# Altium project sonata-board.PrjPcb (part 1 of 2)
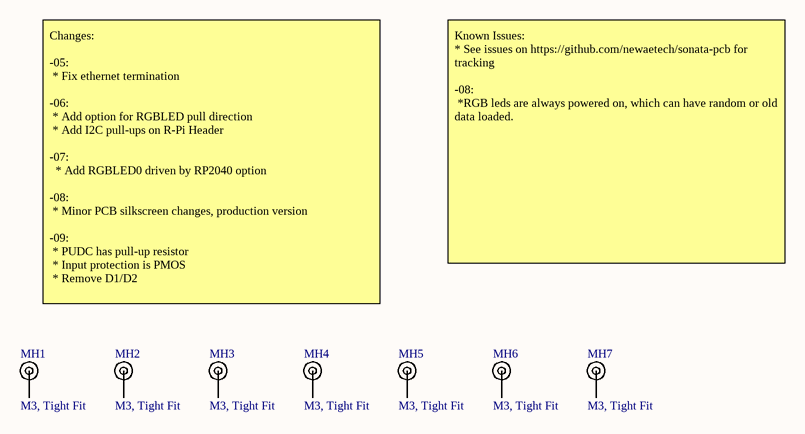
[diagram p0: sb-sonata-mech.SchDoc]
PrjLicense: CC-SA; PrjName: Sonata; PrjRev: 09
9 sheets, 219 parts. Net scope: global (net labels, ports and power ports of the same name join across sheets).
Board file: cheriot-test.PcbDoc
Sheets:
  sb-sonata-mech.SchDoc
  sb-sonata-usbrp.SchDoc
  sb-sonata-industriaal.SchDoc
  sb-sonata-debug.SchDoc
  sb-sonata-led.SchDoc
  sb-sonata-fpgaio2.SchDoc
  sb-sonata-fpganaalog.SchDoc
  sb-sonata-psu.SchDoc
  sb-sonata-hyperram.SchDoc

## Sheet sb-sonata-mech.SchDoc: Mechanical & Title Page
size Letter; Organization: NewAE Technology Inc.; Address1: 1083 Queen St., Suite 196; Address2: Halifax; Address3: NS; Address4: Canada B3H 0B2; SheetNumber: 1; SheetTotal: 20; SheetApproved: YES

### Parts
MH1  M3, Tight Fit  [MOUNT_M3_TIGHT]
MH2  M3, Tight Fit  [MOUNT_M3_TIGHT]
MH3  M3, Tight Fit  [MOUNT_M3_TIGHT]
MH4  M3, Tight Fit  [MOUNT_M3_TIGHT]
MH5  M3, Tight Fit  [MOUNT_M3_TIGHT]
MH6  M3, Tight Fit  [MOUNT_M3_TIGHT]
MH7  M3, Tight Fit  [MOUNT_M3_TIGHT]

### Nets

Not connected (* = marked no-connect by the designer): MH1 1; MH2 1; MH3 1; MH4 1; MH5 1; MH6 1; MH7 1

### Notes on the sheet
- Changes:
  -05:
  * Fix ethernet termination
  -06:
  * Add option for RGBLED pull direction
  * Add I2C pull-ups on R-Pi Header
  -07:
  * Add RGBLED0 driven by RP2040 option
  -08:
  * Minor PCB silkscreen changes, production version
  -09:
  * PUDC has pull-up resistor
  * Input protection is PMOS
  * Remove D1/D2
- Known Issues:
  * See issues on https://github.com/newaetech/sonata-pcb for tracking
  -08:
  *RGB leds are always powered on, which can have random or old data loaded.
- Title:
- Date:
- Rev:
- Time:
- Project:
- Sheet
- of
- License:
- Copyright © NewAE Technology Inc.
- Approved:
- NewAE.com
- File:

### Library data of the parts
MH1-MH7 = MOUNT_M3_TIGHT: Machine screw M3 Mounting Hole; Component Group: Mechanical; PP Material Stack: 0; Part Number: MOUNT_M3_TIGHT; Pin Count: 1; Component Kind: Mechanical; Component Type: Mechanical; PP Rotation: 0

## Sheet sb-sonata-usbrp.SchDoc: RP2040 Controller
size Letter; Organization: NewAE Technology Inc.; Address1: 1083 Queen St., Suite 196; Address2: Halifax; Address3: NS; Address4: Canada B3H 0B2; SheetNumber: 5; SheetTotal: 20; SheetApproved: YES
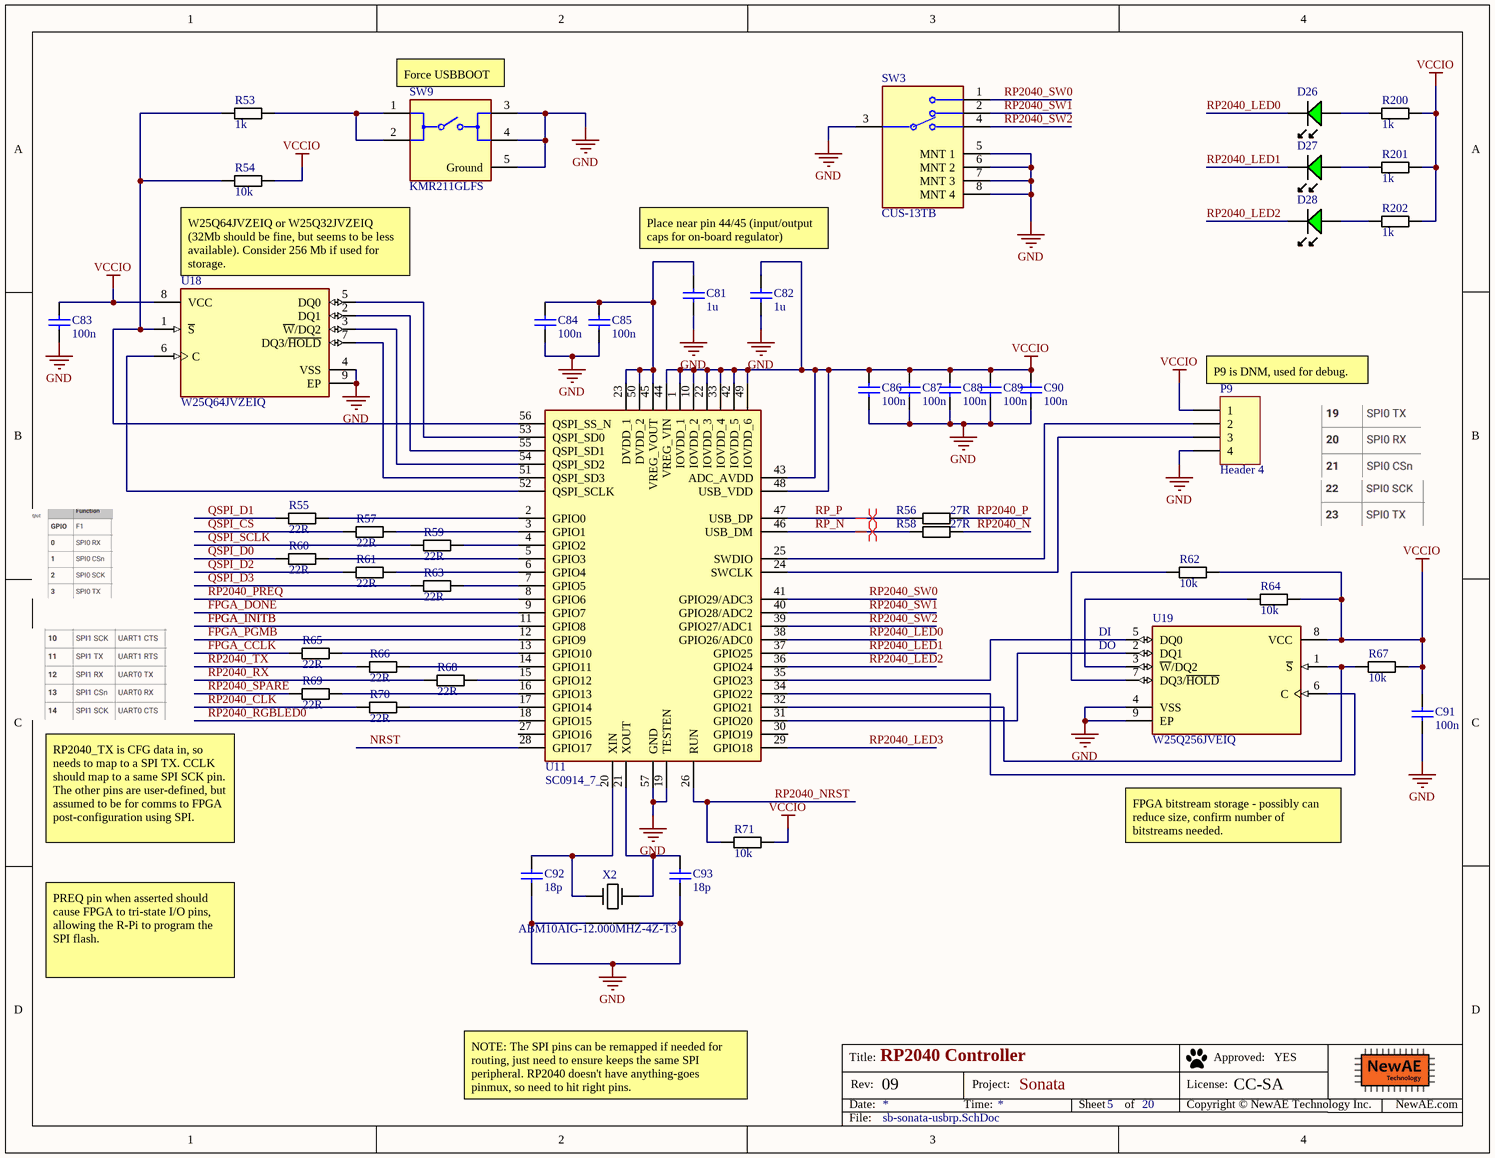
[diagram p1: sb-sonata-usbrp.SchDoc]

### Parts
C81  1u  [CAPC0603_M]
C82  1u  [CAPC0603_M]
C83  100n  [CAPC0402_M]
C84  100n  [CAPC0402_M]
C85  100n  [CAPC0402_M]
C86  100n  [CAPC0402_M]
C87  100n  [CAPC0402_M]
C88  100n  [CAPC0402_M]
C89  100n  [CAPC0402_M]
C90  100n  [CAPC0402_M]
C91  100n  [CAPC0402_M]
C92  18p  [CAPC0402_M]
C93  18p  [CAPC0402_M]
D26  LED, 0603, Green  [LED-0603-GREEN]  (value not drawn)
D27  LED, 0603, Green  [LED-0603-GREEN]  (value not drawn)
D28  LED, 0603, Green  [LED-0603-GREEN]  (value not drawn)
P9  Header 4  [HDR1X4]
R53  1k  [RESC1005X40N]
R54  10k  [RESC1005X40N]
R55  22R  [RESC1005X40N]
R56  27R  [RESC1005X40N]
R57  22R  [RESC1005X40N]
R58  27R  [RESC1005X40N]
R59  22R  [RESC1005X40N]
R60  22R  [RESC1005X40N]
R61  22R  [RESC1005X40N]
R62  10k  [RESC1005X40N]
R63  22R  [RESC1005X40N]
R64  10k  [RESC1005X40N]
R65  22R  [RESC1005X40N]
R66  22R  [RESC1005X40N]
R67  10k  [RESC1005X40N]
R68  22R  [RESC1005X40N]
R69  22R  [RESC1005X40N]
R70  22R  [RESC1005X40N]
R71  10k  [RESC1005X40N]
R200  1k  [RESC1005X40N]
R201  1k  [RESC1005X40N]
R202  1k  [RESC1005X40N]
SW3  CUS-13TB  [FP-CUS-13TB-MFG]
SW9  KMR211GLFS  [FP-KMR211GLFS-MFG]
U11  SC0914_7_  [QFN40P700X700X90-57N-D]
U18  W25Q64JVZEIQ  [WSON68_Micron]
U19  W25Q256JVEIQ  [WSON68_Micron]
X2  ABM10AIG-12.000MHZ-4Z-T3  [2.5x2mm XTAL]

### Nets
GND: C81.2 C82.2 C83.2 C84.2 C85.2 C86.2 C87.2 C88.2 C89.2 C90.2 C91.2 C92.2 C93.2 P9.4 SW3.3(C) SW3.5(MNT_1) SW3.6(MNT_2) SW3.7(MNT_3) SW3.8(MNT_4) SW9.3 SW9.4 SW9.5(Ground) U11.19(TESTEN) U11.57(GND) U18.4(VSS) U18.9(EP) U19.4(VSS) U19.9(EP) X2.2(GND) X2.4(GND)
VCCIO: C82.1 C83.1 C86.1 C87.1 C88.1 C89.1 C90.1 C91.1 P9.1 R54.1 R62.1 R64.1 R67.2 R71.2 R200.2 R201.2 R202.2 U11.1(IOVDD_1) U11.10(IOVDD_2) U11.22(IOVDD_3) U11.33(IOVDD_4) U11.42(IOVDD_5) U11.43(ADC_AVDD) U11.44(VREG_VIN) U11.48(USB_VDD) U11.49(IOVDD_6) U18.8(VCC) U19.8(VCC)  [project net 3V3_FTDI]
FPGA_CCLK: R65.1
FPGA_DONE: U11.9(GPIO7)
FPGA_INITB: U11.11(GPIO8)
FPGA_PGMB: U11.12(GPIO9)
NRST: U11.28(GPIO17)
QSPI_CS: R57.1
QSPI_D0: R60.1
QSPI_D1: R55.1
QSPI_D2: R61.1
QSPI_D3: R63.1
QSPI_SCLK: R59.1
RP2040_CLK: R70.1
RP2040_LED0: D26.K U11.38(GPIO26/ADC0)
RP2040_LED1: D27.K U11.37(GPIO25)
RP2040_LED2: D28.K U11.36(GPIO24)
RP2040_LED3: U11.29(GPIO18)
RP2040_N: R58.1
RP2040_NRST: R71.1 U11.26(RUN)
RP2040_P: R56.1
RP2040_PREQ: U11.8(GPIO6)
RP2040_RGBLED0: U11.18(GPIO15)
RP2040_RX: R68.1
RP2040_SPARE: R69.1
RP2040_SW0: SW3.1 U11.41(GPIO29/ADC3)
RP2040_SW1: SW3.2 U11.40(GPIO28/ADC2)
RP2040_SW2: SW3.4 U11.39(GPIO27/ADC1)
RP2040_TX: R66.1
RP_N: R58.2 U11.46(USB_DM)
RP_P: R56.2 U11.47(USB_DP)
NetC81_1: C81.1 C84.1 C85.1 U11.23(DVDD_1) U11.45(VREG_VOUT) U11.50(DVDD_2)
NetC92_1: C92.1 U11.20(XIN) X2.1(IN)
NetC93_1: C93.1 U11.21(XOUT) X2.3(OUT)
NetD26_A: D26.A R200.1
NetD27_A: D27.A R201.1
NetD28_A: D28.A R202.1
NetP9_2: P9.2 U11.25(SWDIO)
NetP9_3: P9.3 U11.24(SWCLK)
NetR53_1: R53.1 R54.2 U11.56(QSPI_SS_N) U18.1(~{S})
NetR53_2: R53.2 SW9.1 SW9.2
NetR55_2: R55.2 U11.2(GPIO0)
NetR57_2: R57.2 U11.3(GPIO1)
NetR59_2: R59.2 U11.4(GPIO2)
NetR60_2: R60.2 U11.5(GPIO3)
NetR61_2: R61.2 U11.6(GPIO4)
NetR62_2: R62.2 U19.7(DQ3/~{HOLD})
NetR63_2: R63.2 U11.7(GPIO5)
NetR64_2: R64.2 U19.3(~{W}/DQ2)
NetR65_2: R65.2 U11.13(GPIO10)
NetR66_2: R66.2 U11.14(GPIO11)
NetR67_1: R67.1 U11.32(GPIO21) U19.1(~{S})
NetR68_2: R68.2 U11.15(GPIO12)
NetR69_2: R69.2 U11.16(GPIO13)
NetR70_2: R70.2 U11.17(GPIO14)
NetU11_31: U11.31(GPIO20) U19.2(DQ1)
NetU11_34: U11.34(GPIO22) U19.6(C)
NetU11_35: U11.35(GPIO23) U19.5(DQ0)
NetU11_51: U11.51(QSPI_SD3) U18.7(DQ3/~{HOLD})
NetU11_52: U11.52(QSPI_SCLK) U18.6(C)
NetU11_53: U11.53(QSPI_SD0) U18.5(DQ0)
NetU11_54: U11.54(QSPI_SD2) U18.3(~{W}/DQ2)
NetU11_55: U11.55(QSPI_SD1) U18.2(DQ1)

Not connected (* = marked no-connect by the designer): U11 27(GPIO16) 30(GPIO19)

### Layout directives
differential pair; differential pair class USB_DIFF_PAIR: RP_N, RP_P

### Notes on the sheet
- (near SW9) Force USBBOOT
- W25Q64JVZEIQ or W25Q32JVZEIQ (32Mb should be fine, but seems to be less available). Consider 256 Mb if used for storage.
- Place near pin 44/45 (input/output caps for on-board regulator)
- (near P9) P9 is DNM, used for debug.
- (near U19) DI
- (near U19) DO
- RP2040_TX is CFG data in, so needs to map to a SPI TX. CCLK should map to a same SPI SCK pin. The other pins are user-defined, but assumed to be for comms to FPGA post-configuration using SPI.
- FPGA bitstream storage - possibly can reduce size, confirm number of bitstreams needed.
- PREQ pin when asserted should cause FPGA to tri-state I/O pins, allowing the R-Pi to program the SPI flash.
- NOTE: The SPI pins can be remapped if needed for routing, just need to ensure keeps the same SPI peripheral. RP2040 doesn't have anything-goes pinmux, so need to hit right pins.
- Title:
- Date:
- Rev:
- Time:
- Project:
- Sheet
- of
- License:
- Copyright © NewAE Technology Inc.
- Approved:
- NewAE.com
- File:

### Library data of the parts
C81 C82 = CCHIP-1u-0603: 1u, 0603, 50V; Manufacture Part Number 1: CL10A105KB8NNNC; Component Group: Capacitor; Case-EIA: 0603; Case-Metric: 1608; Rated Voltage: 50VDC; Part Number: CCHIP-1u-0603; Footprint: 0603; Pin Count: 2; Supplier 1: Digi-Key; Supplier Part Number 1: 1276-1860-1-ND; Value: 1u; Mounting Technology: SMT; Component Kind: Standard; Component Type: Standard
C83-C91 = CCHIP-100n-0402: 100n, 0402; Manufacture Part Number 1: CGA2B3X7R1V104K050BB; Component Group: Capacitor; Case-EIA: 0402; Part Number: CCHIP-100n-0402; Footprint: 0402; Pin Count: 2; Supplier 1: Digi-Key; Supplier Part Number 1: 445-6901-1-ND; Value: 100n; Mounting Technology: SMT; Component Kind: Standard; Component Type: Standard
C92 C93 = CCHIP-18p-0402: 18p, 0402; Manufacture Part Number 1: GRM1555C1H180JA01D; Component Group: Capacitor; Case-EIA: 0402; Part Number: CCHIP-18p-0402; Footprint: 0402; Pin Count: 2; Supplier 1: Digi-Key; Supplier Part Number 1: 490-5858-1-ND; Value: 18p; Mounting Technology: SMT; Component Kind: Standard; Component Type: Standard
D26-D28 = LEDCHIP_0603_GREEN: Chip LED, Green; Manufacture 1: Kingbright; Manufacture Part Number 1: APT1608CGCK; Component Group: Optical; PP Material Stack: 16; PP Rotation: -90; Part Number: LEDCHIP_0603_GREEN; Pin Count: 2; Supplier 1: Digi-Key; Supplier Part Number 1: 754-1116-1-ND; Mounting Technology: SMT; Component Kind: Standard; Component Type: Standard
P9 = Header 4: Header, 4-Pin; LatestRevisionDate: 17-Jul-2002; LatestRevisionNote: Re-released for DXP Platform.; Publisher: Altium Limited
R53 R200-R202 = RCHIP-1K-0402: 1k res, 0402, 1%, 1/16W; Manufacture 1: Yageo; Manufacture Part Number 1: RC0402FR-071KL; Component Group: Resistor; Case-EIA: 0402; Case-Metric: 1005; Rated Power: 0.063W; Rated Voltage: 75VDC; Part Number: RCHIP-1K-0402; Footprint: 0402; Pin Count: 2; Supplier 1: Digi-Key; Supplier Part Number 1: 311-1.00KLRCT-ND; Value: 1k; Tolerance: 1%; Mounting Technology: SMT; Temperature Range: -55C to 155C; Component Kind: Standard; Component Type: Standard
R54 R62 R64 R67 R71 = RCHIP-10K-0402: 10k res, 0402, 1%, 1/16W; Manufacture 1: Yageo; Manufacture Part Number 1: RC0402FR-0710KL; Component Group: Resistor; Case-EIA: 0402; Case-Metric: 1005; Rated Power: 0.063W; Rated Voltage: 75VDC; Part Number: RCHIP-10K-0402; Footprint: 0402; Pin Count: 2; Supplier 1: Digi-Key; Supplier Part Number 1: 311-10.0KLRCT-ND; Value: 10k; Tolerance: 1%; Mounting Technology: SMT; Temperature Range: -55C to 155C; Component Kind: Standard; Component Type: Standard
R55 R57 R59-R61 R63 R65 R66 R68-R70 = RCHIP-22R-0402: 22R res, 0402, 1%, 1/16W; Manufacture 1: Yageo; Manufacture Part Number 1: RC0402FR-0722RL; Component Group: Resistor; Case-EIA: 0402; Case-Metric: 1005; Rated Power: 0.063W; Rated Voltage: 75VDC; Part Number: RCHIP-22R-0402; Footprint: 0402; Pin Count: 2; Supplier 1: Digi-Key; Supplier Part Number 1: 311-22.0LRCT-ND; Value: 22R; Tolerance: 1%; Mounting Technology: SMT; Temperature Range: -55C to 155C; Component Kind: Standard; Component Type: Standard
R56 R58 = RCHIP-27R-0402: 27R res, 0402, 1%, 1/16W; Manufacture 1: Yageo; Manufacture Part Number 1: RC0402FR-0727RL; Component Group: Resistor; Case-EIA: 0402; Case-Metric: 1005; Rated Power: 0.063W; Rated Voltage: 75VDC; Part Number: RCHIP-27R-0402; Footprint: 0402; Pin Count: 2; Supplier 1: Digi-Key; Supplier Part Number 1: YAG3086CT-ND; Value: 27R; Tolerance: 1%; Mounting Technology: SMT; Temperature Range: -55C to 155C; Component Kind: Standard; Component Type: Standard
SW3 = CMP-71745-000014-1: SWITCH SLIDE SP3T 300MA 4V; Actuator Length: 1.5mm; Electrical Life: 10000Cycles; Max Voltage Rating (DC): 20V; Switch Function: On-On-On; Actuator Material: Nylon; Actuator Type: Standard; Contact Style: Non-Shorting; Contact Plating: Gold; Termination: Gull Wing; Radiation Hardening: No; Series: CUS; Max Operating Temperature: 70°C; Mount: Surface Mount; Switch Travel: 1.5mm; Packaging: Tape and Reel; Min Operating Temperature: -20°C; Contact Material: Copper Alloy; Orientation: Right Angle; Voltage Rating (DC): 4V; RoHS Compliant: Yes; Current Rating: 300mA; Throw Configuration: SP3T
SW9 = CMP-10040-000023-1: SWITCH TACTILE SPST-NO 0.05A 32V; Switch Function: Off-Mom; Throw Configuration: SPST; Switch Travel: 0.2mm; Current Rating: 50mA; Illumination Type: Non-Illuminated; Actuator Length: 0.5mm; Power Rating: 1W; Operating Force: 1.2N; Actuator Type: Standard; Mechanical Life: 200000Cycles; REACH SVHC: No SVHC; Voltage Rating (DC): 32V; Length: 2.8mm; Min Operating Temperature: -40°C; Mount: Surface Mount; Max Voltage Rating (DC): 32V; Width: 2.8mm; Depth: 4.6mm; Packaging: Tape and Reel; Lead Free: Lead Free; Contact Material: Silver; Termination: Gull Wing; Package Quantity: 1; Contact Current Rating: 50mA; Orientation: Straight; Max Operating Temperature: 85°C; Radiation Hardening: No; Max Current Rating: 50mA; Contact Plating: Silver
U11 = SC0914_7_: Connector; Manufacturer_Name: RASPBERRY-PI; Manufacturer_Part_Number: SC0914(7); Datasheet Link: https://www.mouser.com/datasheet/2/635/rp2040_datasheet-3048960.pdf; Height: 0.9mm; Mouser Part Number: 358-SC09147; Mouser Price/Stock: https://www.mouser.co.uk/ProductDetail/Raspberry-Pi/SC09147?qs=T%252BzbugeAwjhSpdbCB4ve%252Bg%3D%3D
U18 = MT25QL256ABA1EW9-0SIT: IC FLASH 64M SPI 133MHZ 8WPDFN; Manufacture 1: Winbond; Component Group: Digital IC; PP Material Stack: 0; Part Number: W25Q64JVZEIQ; Footprint: WSON-8x6; Manufacture Part Number 1: W25Q64JVZEIQ; Pin Count: 9; Supplier 1: Digi-Key; Mounting Technology: SMT; RoHS: Yes; Component Kind: Standard; Component Type: Standard; PP Rotation: 0; PP Rotation1: 0
U19 = MT25QL256ABA1EW9-0SIT: IC FLASH 256M SPI 133MHZ 8WPDFN; Manufacture 1: Winbond; Component Group: Digital IC; PP Material Stack: 0; Part Number: W25Q256JVEIQ; Footprint: WSON-8x6; Manufacture Part Number 1: W25Q256JVEIQ; Pin Count: 9; Supplier 1: Digi-Key; Mounting Technology: SMT; RoHS: Yes; Component Kind: Standard; Component Type: Standard; PP Rotation: 0; PP Rotation1: 0
X2 = ABM10AIG-12.000MHZ-4Z-T3: 12MHz, SMD; Manufacture 1: Abracon LLC; Component Group: Crystal; PP Material Stack: 0; Part Number: ABM10AIG-12.000MHZ-4Z-T3; Manufacture Part Number 1: ABM10AIG-12.000MHZ-4Z-T3; Pin Count: 4; Supplier 1: Digi-Key; Supplier Part Number 1: 535-13360-1-ND; Value: 12.000MHz; Mounting Technology: SMT; Component Kind: Standard; Component Type: Standard; PP Rotation: 0

## Sheet sb-sonata-industriaal.SchDoc: RS485,RS232,Eth Connectors
size Letter; Organization: NewAE Technology Inc.; Address1: 1083 Queen St., Suite 196; Address2: Halifax; Address3: NS; Address4: Canada B3H 0B2; SheetNumber: 6; SheetTotal: 20; SheetApproved: YES
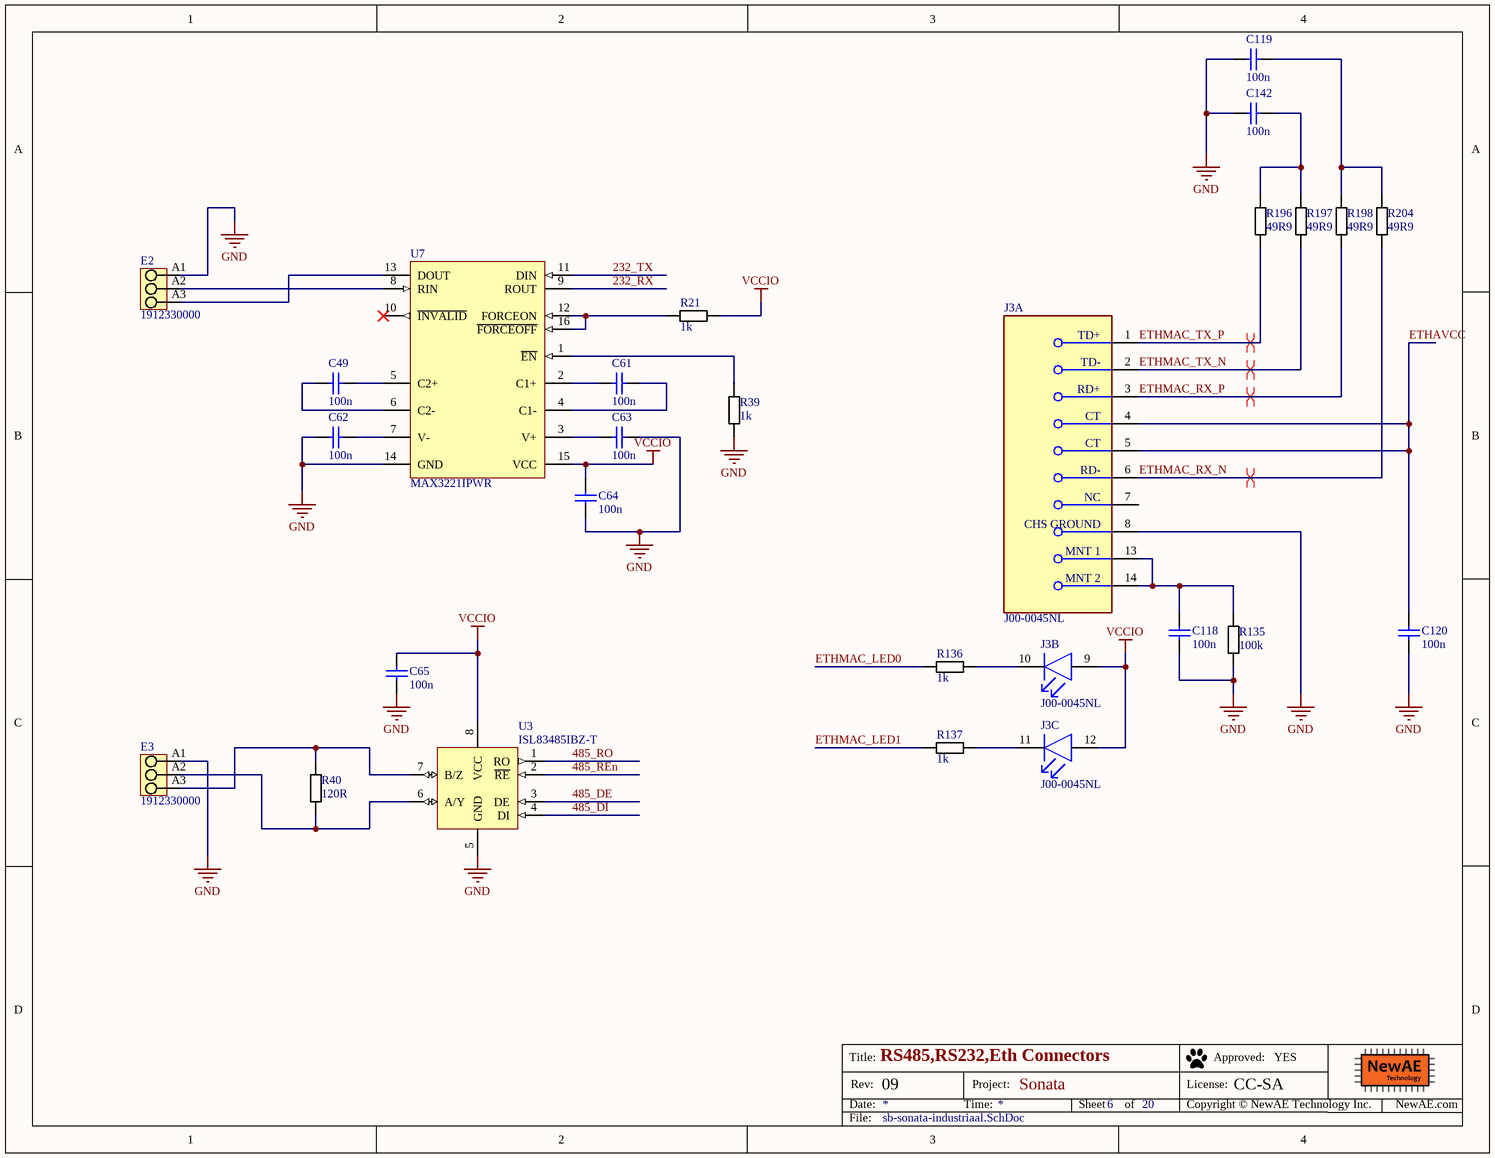
[diagram p2: sb-sonata-industriaal.SchDoc]

### Parts
C49  100n  [CAPC0402_M]
C61  100n  [CAPC0402_M]
C62  100n  [CAPC0402_M]
C63  100n  [CAPC0402_M]
C64  100n  [CAPC0402_M]
C65  100n  [CAPC0402_M]
C118  100n  [CAPC0402_M]
C119  100n  [CAPC0402_M]
C120  100n  [CAPC0402_M]
C142  100n  [CAPC0402_M]
E2  1912330000  [PS_3_5_90_03]
E3  1912330000  [PS_3_5_90_03]
J3  J00-0045NL  [FP-J00-0045NL-MFG]  (parts A,B,C of 3)
R21  1k  [RESC1608X55N]
R39  1k  [RESC1608X55N]
R40  120R  [RESC1608X55N]
R135  100k  [RESC1005X40N]
R136  1k  [RESC1608X55N]
R137  1k  [RESC1608X55N]
R196  49R9  [RESC2012X70N]
R197  49R9  [RESC2012X70N]
R198  49R9  [RESC2012X70N]
R204  49R9  [RESC2012X70N]
U3  ISL83485IBZ-T  [SOIC8_NARROW]
U7  MAX3221IPWR  [PW0016A_L]

### Nets
GND: C62.2 C63.1 C64.1 C65.2 C118.2 C119.1 C120.2 C142.1 E2.A1 E3.A1 J3.8(CHS_GROUND) R39.2 R135.2 U3.5(GND) U7.14(GND)
VCCIO: C64.2 C65.1 J3.9(GREEN_A) J3.12(YELLOW_ANODE) R21.2 U3.8(VCC) U7.15(VCC)  [project net 3V3_FTDI]
232_RX: U7.9(ROUT)
232_TX: U7.11(DIN)
485_DE: U3.3(DE)
485_DI: U3.4(DI)
485_REn: U3.2(~{RE})
485_RO: U3.1(RO)
ETHAVCC: C120.1 J3.4(CT) J3.5(CT)
ETHMAC_LED0: R136.1
ETHMAC_LED1: R137.1
ETHMAC_RX_N: J3.6(RD-) R204.2
ETHMAC_RX_P: J3.3(RD+) R198.2
ETHMAC_TX_N: J3.2(TD-) R197.2
ETHMAC_TX_P: J3.1(TD+) R196.2
NetC49_1: C49.1 U7.5(C2+)
NetC49_2: C49.2 U7.6(C2-)
NetC61_1: C61.1 U7.4(C1-)
NetC61_2: C61.2 U7.2(C1+)
NetC62_1: C62.1 U7.7(V-)
NetC63_2: C63.2 U7.3(V+)
NetC118_1: C118.1 J3.13(MNT_1) J3.14(MNT_2) R135.1
NetC119_2: C119.2 R198.1 R204.1
NetC142_2: C142.2 R196.1 R197.1
NetE2_A2: E2.A2 U7.8(RIN)
NetE2_A3: E2.A3 U7.13(DOUT)
NetE3_A2: E3.A2 R40.2 U3.6(A/Y)
NetE3_A3: E3.A3 R40.1 U3.7(B/Z)
NetJ3_10: J3.10(GREEN_C) R136.2
NetJ3_11: J3.11(YELLOW_CATHODE) R137.2
NetR21_1: R21.1 U7.12(FORCEON) U7.16(~{FORCEOFF})
NetR39_1: R39.1 U7.1(~{EN})

Not connected (* = marked no-connect by the designer): J3 7(NC); U7 10(~{INVALID})*

### Layout directives
differential pair; differential pair class ETHERNET: ETHMAC_RX_N, ETHMAC_RX_P, ETHMAC_TX_N, ETHMAC_TX_P

### Notes on the sheet
- Title:
- Date:
- Rev:
- Time:
- Project:
- Sheet
- of
- License:
- Copyright © NewAE Technology Inc.
- Approved:
- NewAE.com
- File:

### Library data of the parts
C49 C61-C65 C118-C120 C142 = CCHIP-100n-0402: as C83 on sheet sb-sonata-usbrp; Part Number: CCHIP-100n-0402; Footprint: 0402; Pin Count: 2; Supplier 1: Digi-Key; Supplier Part Number 1: 445-6901-1-ND; Value: 100n; Mounting Technology: SMT; Component Kind: Standard; Component Type: Standard
E2 E3 = CMP-1559-01636-1: OMNIMATE Signal - series PS; Manufacturer: Weidmueller; No_of_poles: 3; Side_termination_characteristic: closed side; Pitch_inch: 0,138 inch; Short_text_for_material: PS 3.50/03/90 3.5SN OR BX; Wire_cross_section_AWG_max_UL_1059: AWG 16; Rated_voltage_use_group_B_UL_1059: 300 V; Solid_min_H05_07_V_U: 0,2 mm²; Contact_surface: tinned; UL_94_flammability_rating: V-0; Pitch_mm: 3,5 mm; Contact_material: Cu-Leg; Rated_current_use_group_B_UL_1059: 10 A; Solid_max_H05_07_V_U: 1,5 mm²; Mounting_onto_the_PCB: Solder connection; Rated_voltage_for_surge_voltage_class_pollution_degree_II_2: 320 V; Insulating_material: Wemid (PA); Wire_cross_section_AWG_min_UL_1059: AWG 28; Revision: V1; ComponentLink2Description: URL Link1; Packaging: Box; Qty: 100 PCS; ComponentLink2URL: http://catalog.weidmueller.com/catalog/Start.do?localeId=en&ObjectID=1912330000; PackageReference: PS_3_5_90_03; ComponentLink1Description: Manufacturer URL; ComponentLink1URL: http://www.weidmueller.com/; Solder_pin_length_mm: 3,5 mm; PartNumber: 1912330000; Colour: Orange
J3 = CMP-16436-000005-1: CONN JACK 1PORT 100 BASE-TX PCB; Number of Cores per Jack: 4; Gender: Female; Connector Type: RJ45; Number of Positions Loaded: 8; Current Rating: 8mA; Pitch: 2.54mm; Shielding: Shielded; Direction: Down; Number of Ports: 1; Depth: 21.59mm; Radiation Hardening: No; Contact Material: Bronze; Contact Plating: Gold; Mount: Through Hole; Max Operating Temperature: 70°C; Packaging: Rail/Tube; Color: Green; Number of Contacts: 8; Lead Free: Lead Free; Series: STARJACK™ J00; Package Quantity: 30; Length: 16.26mm; Number of Rows: 1; Min Operating Temperature: 0°C; Termination: Solder; Orientation: Right Angle; Housing Material: Thermoplastic
R21 R39 R136 R137 = RCHIP-1K-0603: 1k res, 0603, 1%, 1/10W; Manufacture 1: Yageo; Manufacture Part Number 1: RC0603FR-071KL; Component Group: Resistor; Case-EIA: 0603; Case-Metric: 1608; Rated Power: 0.1W; Rated Voltage: 75VDC; Part Number: RCHIP-1K-0603; Footprint: 0603; Pin Count: 2; Supplier 1: Digi-Key; Supplier Part Number 1: 311-1.00KHRCT-ND; Value: 1k; Tolerance: 1%; Mounting Technology: SMT; Temperature Range: -55C to 155C; Component Kind: Standard; Component Type: Standard
R40 = RCHIP-120R-0603: 120R res, 0603, 1%, 1/10W; Manufacture 1: Yageo; Manufacture Part Number 1: RC0603FR-07120RL; Component Group: Resistor; Case-EIA: 0603; Case-Metric: 1608; Rated Power: 0.1W; Rated Voltage: 75VDC; Part Number: RCHIP-120R-0603; Footprint: 0603; Pin Count: 2; Supplier 1: Digi-Key; Supplier Part Number 1: 311-120HRCT-ND; Value: 120R; Tolerance: 1%; Mounting Technology: SMT; Temperature Range: -55C to 155C; Component Kind: Standard; Component Type: Standard
R135 = RCHIP-100K-0402: 100k res, 0402, 1%, 1/16W; Manufacture 1: Yageo; Manufacture Part Number 1: RC0402FR-07100KL; Component Group: Resistor; Case-EIA: 0402; Case-Metric: 1005; Rated Power: 0.063W; Rated Voltage: 75VDC; Part Number: RCHIP-100K-0402; Footprint: 0402; Pin Count: 2; Supplier 1: Digi-Key; Supplier Part Number 1: 311-100KLRCT-ND; Value: 100k; Tolerance: 1%; Mounting Technology: SMT; Temperature Range: -55C to 155C; Component Kind: Standard; Component Type: Standard
R196-R198 R204 = RCHIP-49R9-0805: 49r9 res, 0805, 1%, 1/8W; Manufacture 1: Yageo; Manufacture Part Number 1: RC0805FR-0749R9L; Component Group: Resistor; Case-EIA: 0805; Case-Metric: 2012; Rated Power: 0.125W; Rated Voltage: 75VDC; Part Number: RCHIP-49R9-0805; Footprint: 0805; Pin Count: 2; Supplier 1: Digi-Key; Supplier Part Number 1: 311-49.9CRCT-ND; Value: 49R9; Tolerance: 1%; Mounting Technology: SMT; RoHS: Yes; Temperature Range: -55C to 155C; Component Kind: Standard; Component Type: Standard
U3 = ISL83485I: IC TXRX RS422/RS485; Manufacture 1: Renesas; Component Group: Digital IC; Part Number: ISL83485I; Footprint: SOIC8; Manufacture Part Number 1: ISL83485IBZ-T; Pin Count: 8; Supplier 1: Digi-Key; Supplier Part Number 1: ISL83485IBZ-TCT-ND; Mounting Technology: SMT; RoHS: Yes; Component Kind: Standard; Component Type: Standard
U7 = CMP-0299-01761-2: 3-V to 5.5-V Single-Channel RS-232 Line Driver / Receiver with ±15-kV ESD Protection, -40 to 85 degC, 16-Pin TSSOP (PW), Green (RoHS & no Sb/Br); Drivers Per Package: 1; ESD HBM(kV): +/-15; Supply Voltage(s)(V): 3.3 or 5.0; RS-232: TRUE; ComponentLink2Description: Datasheet; ComponentLink3URL: http://www.ti.com/litv/pdf/mpds361; SubFamily: RS-232; PackageDescription: 16-Pin Plastic Thin Small Outline Package 5 x 4.4 mm Body ,0.65 mm Pitch; ICC(Max)(mA): 1; PackageReference: PW0016A; Receivers Per Package: 1; DatasheetVersion: SLLS348M; PackageVersion: revG, Feb-2011; ComponentLink1URL: www.ti.com; ComponentLink1Description: Manufacturer URL; ComponentLink2URL: http://www.ti.com/general/docs/lit/getliterature.tsp?genericPartNumber=MAX3221&fileType=pdf; ComponentLink3Description: Package Specification; Single Supply: TRUE

## Sheet sb-sonata-debug.SchDoc: FTDI Interface (Debug Programming)
size Letter; Organization: NewAE Technology Inc.; Address1: 1083 Queen St., Suite 196; Address2: Halifax; Address3: NS; Address4: Canada B3H 0B2; SheetNumber: 7; SheetTotal: 20; SheetApproved: YES
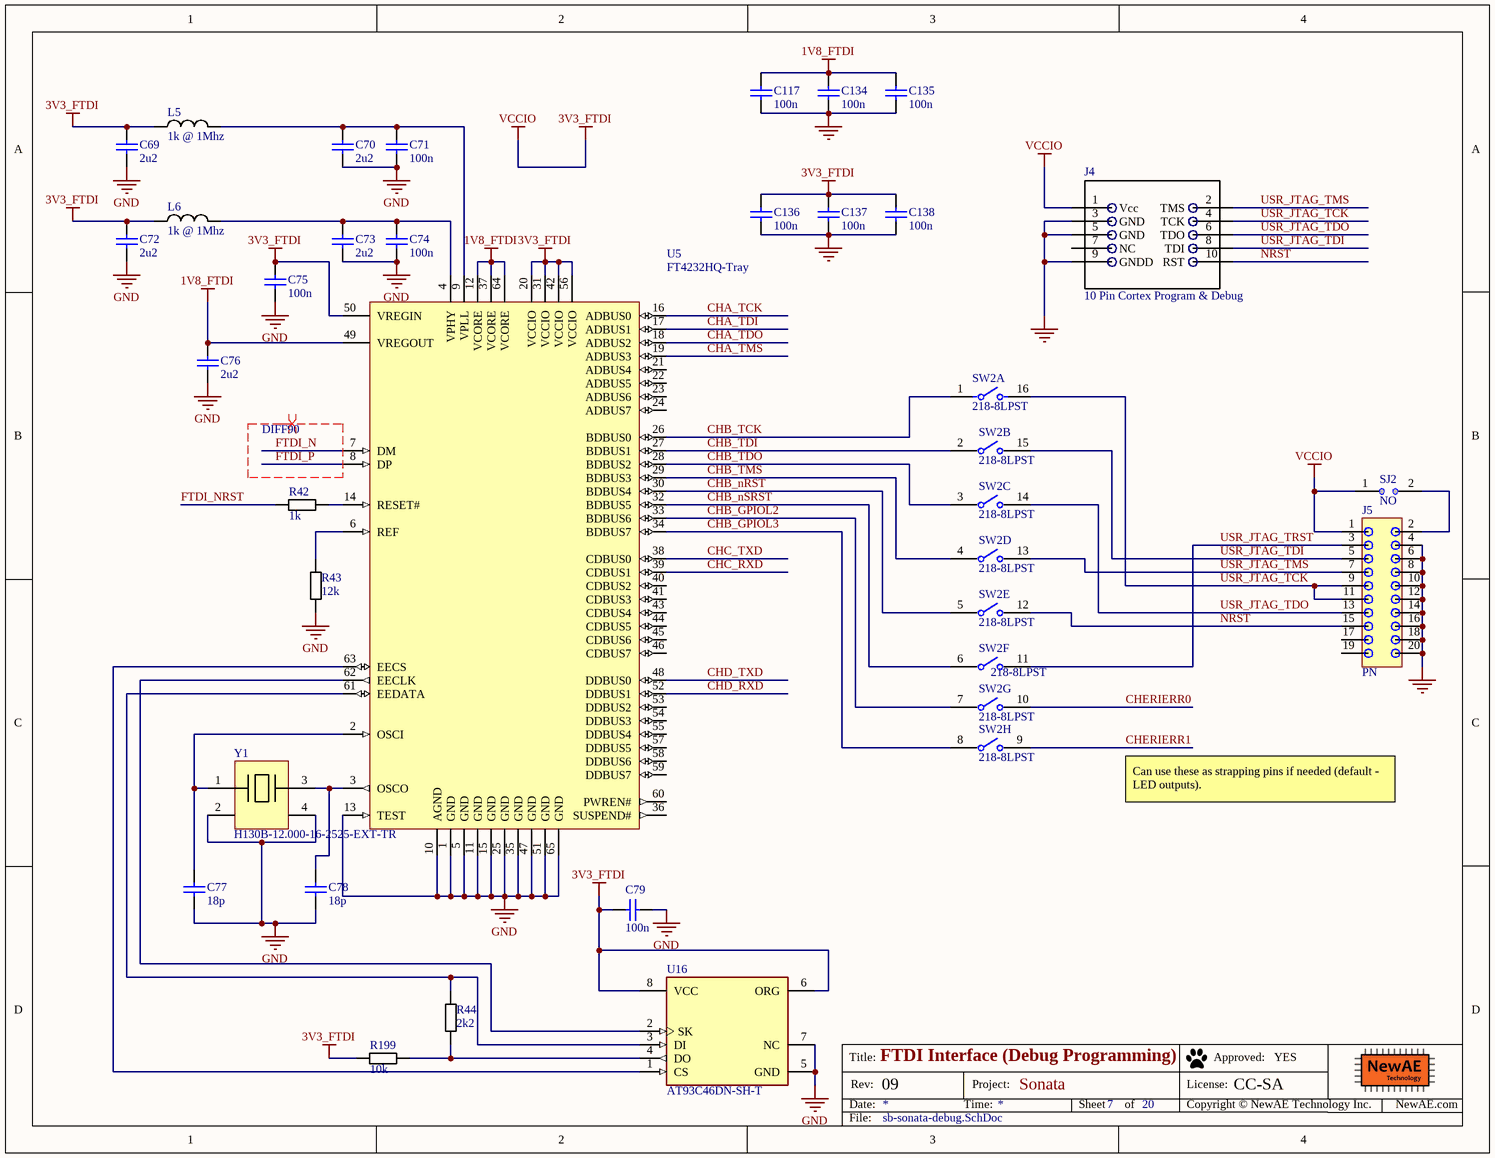
[diagram p3: sb-sonata-debug.SchDoc]

### Parts
C69  2u2  [CAPC0603_M]
C70  2u2  [CAPC0603_M]
C71  100n  [CAPC0402_M]
C72  2u2  [CAPC0603_M]
C73  2u2  [CAPC0603_M]
C74  100n  [CAPC0402_M]
C75  100n  [CAPC0402_M]
C76  2u2  [CAPC0603_M]
C77  18p  [CAPC0402_M]
C78  18p  [CAPC0402_M]
C79  100n  [CAPC0402_M]
C117  100n  [CAPC0402_M]
C134  100n  [CAPC0402_M]
C135  100n  [CAPC0402_M]
C136  100n  [CAPC0402_M]
C137  100n  [CAPC0402_M]
C138  100n  [CAPC0402_M]
J4  10 Pin Cortex Program & Debug  [0.5mm_SMD_Header_5x2]
J5  PN  [CONN_10x2_SHROUDED_2.54mm]
L5  1k @ 1Mhz  [IND_0603]
L6  1k @ 1Mhz  [IND_0603]
R42  1k  [RESC1005X40N]
R43  12k  [RESC1608X55N]
R44  2k2  [RESC1005X40N]
R199  10k  [RESC1005X40N]
SJ2  NO  [SJ_2S_NO]  (no BOM)
SW2  218-8LPST  [FP-218-8LPST-MFG]  (parts A,B,C,D,E,F,G,H of 8)
U5  FT4232HQ-Tray  [QFN64_2_N]
U16  AT93C46DN-SH-T  [FP-C04-057-SN-MFG]
Y1  H130B-12.000-16-2525-EXT-TR  [5x3.2MM XTAL]

### Nets
1V8_FTDI: C76.1 C117.1 C134.1 C135.1 U5.12(VCORE) U5.37(VCORE) U5.49(VREGOUT) U5.64(VCORE)
3V3_FTDI: C69.1 C72.1 C75.1 C79.1 C136.1 C137.1 C138.1 J4.1(Vcc) J5.1 L5.1 L6.1 R199.1 SJ2.1 U5.20(VCCIO) U5.31(VCCIO) U5.42(VCCIO) U5.50(VREGIN) U5.56(VCCIO) U16.6(ORG) U16.8(VCC)  [also labelled VCCIO]
GND: C69.2 C70.2 C71.2 C72.2 C73.2 C74.2 C75.2 C76.2 C77.2 C78.2 C79.2 C117.2 C134.2 C135.2 C136.2 C137.2 C138.2 J4.3(GND) J4.5(GND) J4.9(GNDD) J5.4 J5.6 J5.8 J5.10 J5.12 J5.14 J5.16 J5.18 J5.20 R43.2 U5.1(GND) U5.5(GND) U5.10(AGND) U5.11(GND) U5.13(TEST) U5.15(GND) U5.25(GND) U5.35(GND) U5.47(GND) U5.51(GND) U5.65(GND) U16.5(GND) U16.7(NC) Y1.2 Y1.4
CHA_TCK: U5.16(ADBUS0)
CHA_TDI: U5.17(ADBUS1)
CHA_TDO: U5.18(ADBUS2)
CHA_TMS: U5.19(ADBUS3)
CHB_GPIOL2: SW2.7 U5.33(BDBUS6)
CHB_GPIOL3: SW2.8 U5.34(BDBUS7)
CHB_nRST: SW2.5 U5.30(BDBUS4)
CHB_nSRST: SW2.6 U5.32(BDBUS5)
CHB_TCK: SW2.1 U5.26(BDBUS0)
CHB_TDI: SW2.2 U5.27(BDBUS1)
CHB_TDO: SW2.3 U5.28(BDBUS2)
CHB_TMS: SW2.4 U5.29(BDBUS3)
CHC_RXD: U5.39(CDBUS1)
CHC_TXD: U5.38(CDBUS0)
CHD_RXD: U5.52(DDBUS1)
CHD_TXD: U5.48(DDBUS0)
CHERIERR0: SW2.10
CHERIERR1: SW2.9
FTDI_N: U5.7(DM)
FTDI_NRST: R42.2
FTDI_P: U5.8(DP)
NRST: J4.10(RST) J5.15 SW2.12
USR_JTAG_TCK: J4.4(TCK) J5.9 J5.11 SW2.16
USR_JTAG_TDI: J4.8(TDI) J5.5 SW2.15
USR_JTAG_TDO: J4.6(TDO) J5.13 SW2.14
USR_JTAG_TMS: J4.2(TMS) J5.7 SW2.13
USR_JTAG_TRST: J5.3 SW2.11
NetC70_1: C70.1 C71.1 L5.2 U5.9(VPLL)
NetC73_1: C73.1 C74.1 L6.2 U5.4(VPHY)
NetC77_1: C77.1 U5.2(OSCI) Y1.1
NetC78_1: C78.1 U5.3(OSCO) Y1.3
NetJ5_2: J5.2 SJ2.2
NetR42_1: R42.1 U5.14(RESET#)
NetR43_1: R43.1 U5.6(REF)
NetR44_1: R44.1 U5.61(EEDATA) U16.3(DI)
NetR44_2: R44.2 R199.2 U16.4(DO)
NetU5_62: U5.62(EECLK) U16.2(SK)
NetU5_63: U5.63(EECS) U16.1(CS)

Not connected (* = marked no-connect by the designer): J4 7(NC); J5 17(9) 19(9); U5 21(ADBUS4) 22(ADBUS5) 23(ADBUS6) 24(ADBUS7) 36(SUSPEND#) 40(CDBUS2) 41(CDBUS3) 43(CDBUS4) 44(CDBUS5) 45(CDBUS6) 46(CDBUS7) 53(DDBUS2) 54(DDBUS3) 55(DDBUS4) 57(DDBUS5) 58(DDBUS6) 59(DDBUS7) 60(PWREN#)

### Layout directives
differential pair; differential pair class DIFF90: FTDI_N, FTDI_P

### Notes on the sheet
- Can use these as strapping pins if needed (default - LED outputs).
- Title:
- Date:
- Rev:
- Time:
- Project:
- Sheet
- of
- License:
- Copyright © NewAE Technology Inc.
- Approved:
- NewAE.com
- File:

### Library data of the parts
C69 C70 C72 C73 C76 = CCHIP-2u2-0603: 2u2, 0603; Manufacture 1: Samsung; Manufacture Part Number 1: CL10B225KP8NNNC; Component Group: Capacitor; Case-EIA: 0603; Case-Metric: 1608; Rated Voltage: 10VDC; Part Number: CCHIP-2u2-0603; Footprint: 0603; Pin Count: 2; Supplier 1: Digi-Key; Supplier Part Number 1: 1276-1134-1-ND; Value: 2u2; Mounting Technology: SMT; Component Kind: Standard; Component Type: Standard
C71 C74 C75 C79 C117 C134-C138 = CCHIP-100n-0402: as C83 on sheet sb-sonata-usbrp; Part Number: CCHIP-100n-0402; Footprint: 0402; Pin Count: 2; Supplier 1: Digi-Key; Supplier Part Number 1: 445-6901-1-ND; Value: 100n; Mounting Technology: SMT; Component Kind: Standard; Component Type: Standard
C77 C78 = CCHIP-18p-0402: as C92 on sheet sb-sonata-usbrp; Part Number: CCHIP-18p-0402; Footprint: 0402; Pin Count: 2; Supplier 1: Digi-Key; Supplier Part Number 1: 490-5858-1-ND; Value: 18p; Mounting Technology: SMT; Component Kind: Standard; Component Type: Standard
J4 = Cortex_Debug_Header_10Pin: 10 Pin Cortex Program & Debug 0.5mm pitch; Manufacture Part Number 1: 20021121-00010C4LF; Component Group: Connector; PP Material Stack: 0; Part Number: Cortex_Debug_Header_10Pin; Pin Count: 10; Supplier 1: Digi-Key; Supplier Part Number 1: 609-3695-1-ND; Mounting Technology: SMT; RoHS: Yes; Component Kind: Standard; Component Type: Standard; PP Rotation: 0
J5 = CONN20_2ROW: Header, 2-Row, 20-pin, 0.1"; Component Group: Connector; Part Number: CONN20_2ROW; Pin Count: 20; Mounting Technology: SMT; Component Kind: Standard; Component Type: Standard
L5 L6 = FBCHIP-1k-0603: Ferrite Beads HI CUR CHIP BD 0603 1000OHMS 25%; Manufacture 1: Taiyo Yuden; Manufacture Part Number 1: FBMH1608HM102-T / FBMH1608HM102-T / FBMH1608HM102-T / FBMH1608HM102-T; Component Group: Inductor; PP Material Stack: 0; Part Number: FBCHIP-1k-0603; Footprint: 0603; Pin Count: 2; Supplier 1: Mouser; Supplier Part Number 1: 963-FBMH1608HM102-T; Mounting Technology: SMT; RoHS: Yes; Component Kind: Standard; Component Type: Standard; PP Rotation: 0
R42 = RCHIP-1K-0402: as R53 on sheet sb-sonata-usbrp; Part Number: RCHIP-1K-0402; Footprint: 0402; Pin Count: 2; Supplier 1: Digi-Key; Supplier Part Number 1: 311-1.00KLRCT-ND; Value: 1k; Tolerance: 1%; Mounting Technology: SMT; Temperature Range: -55C to 155C; Component Kind: Standard; Component Type: Standard
R43 = RCHIP-12K-0603: 12k res, 0603, 1%, 1/10W; Manufacture 1: Yageo; Manufacture Part Number 1: RC0603FR-0712KL; Component Group: Resistor; Case-EIA: 0603; Case-Metric: 1608; Rated Power: 0.1W; Rated Voltage: 75VDC; Part Number: RCHIP-12K-0603; Footprint: 0603; Pin Count: 2; Supplier 1: Digi-Key; Supplier Part Number 1: 311-12.0KHRCT-ND; Value: 12k; Tolerance: 1%; Mounting Technology: SMT; Temperature Range: -55C to 155C; Component Kind: Standard; Component Type: Standard
R44 = RCHIP-2K2-0402: 2k2 res, 0402, 1%, 1/16W; Manufacture 1: Yageo; Manufacture Part Number 1: RC0402FR-072K2L; Component Group: Resistor; Case-EIA: 0402; Case-Metric: 1005; Rated Power: 0.063W; Rated Voltage: 75VDC; Part Number: RCHIP-2K2-0402; Footprint: 0402; Pin Count: 2; Supplier 1: Digi-Key; Supplier Part Number 1: 311-2.20KLRCT-ND; Value: 2k2; Tolerance: 1%; Mounting Technology: SMT; Temperature Range: -55C to 155C; Component Kind: Standard; Component Type: Standard
R199 = RCHIP-10K-0402: as R54 on sheet sb-sonata-usbrp; Part Number: RCHIP-10K-0402; Footprint: 0402; Pin Count: 2; Supplier 1: Digi-Key; Supplier Part Number 1: 311-10.0KLRCT-ND; Value: 10k; Tolerance: 1%; Mounting Technology: SMT; Temperature Range: -55C to 155C; Component Kind: Standard; Component Type: Standard
SJ2 = SJ_2S_NO: Solder Jumper, NO; Component Group: PCB Feature; Part Number: SJ_2S_NO; Pin Count: 2; Mounting Technology: COPPER; Component Type: Standard (No BOM)
SW2 = CMP-07018-000007-1: SWITCH SLIDE DIP SPST 25MA 24V; Number of Positions: 8; Pitch: 0.05inch; Actuator Type: Slide (Standard); Electrical Life: 1000Cycles; Washable: Yes; Contact Resistance: 100mR; Radiation Hardening: No; Packaging: Rail/Tube; Length: 0.446inch; Depth: 8.44mm; Max Voltage Rating (DC): 24V; Lead Free: Lead Free; Mount: Surface Mount; RoHS Compliant: Yes; Series: 218; Max Operating Temperature: 85°C; Termination: Gull Wing; Voltage Rating (DC): 24V; Current Rating: 25mA; Contact Plating: Gold; Min Operating Temperature: -55°C; Terminal Pitch: 1.27mm; Contact Material: Copper; Throw Configuration: SPST; Orientation: Straight; Max Current Rating: 25mA; Height: 2.65mm; Package Quantity: 40
U5 = CMP-0078-00002-3: Quad High Speed USB To Multipurpose UART/MPSSE IC, 64-pin QFN, Tray; Manufacturer: FTDI; PackageDescription: 64-Pin Quad Flat No-Lead, 9 x 9 mm Body, 0.5 mm Pitch, 4.35 x 4.35 mm Exposed Pad; PackageVersion: Jan-12; ComponentLink2URL: http://www.ftdichip.com/Support/Documents/DataSheets/ICs/DS_FT4232H.pdf; RevisionNote: DatasheetVersion updated to 2.2 Jan-2012; ComponentLink1Description: Manufacturer URL; DatasheetVersion: ver 2.2, Jan-2012; PackageReference: QFN64_2; ComponentLink2Description: Datasheet; ComponentLink1URL: http://www.ftdichip.com/; PartNumber: FT4232HQ-Tray
U16 = CMP-06313-000016-1: IC EEPROM 1K SPI 2MHZ 8SOIC; Manufacturer: Microchip; Nominal Supply Current: 0.5mA; Memory Size: 1Kbits; Access Time: 1000ns; Max Supply Voltage: 5.5V; Interface: Other; Standoff Height: 0.1mm; Min Supply Voltage: 1.8V; Category: IC; Temperature Range High: +85°C; Mouser Description: EEPROM Serial-3Wire 1K-Bit 128 x 8/64 x 16 2.5V/3.3V/5V 8-Pin SOIC T/R; Ipc Land Pattern Name: SOIC127P600X175-8; Temperature Range Low: -40°C; Temperature: -40°C to +85°C; Digikey Description: IC EEPROM 1K SPI 2MHZ 8SOIC; Lead Free: Yes; Device Class L2: Memory; ComponentLink2URL: http://ww1.microchip.com/downloads/en/DeviceDoc/20006224B.pdf; Automotive: No; Device Class L3: EEPROM; Package: C04-057-SN; Octopart: https://octopart.com/at93c46dn-sh-t-microchip-77759177; RoHS: TRUE; Memory Type: EEPROM; Height: 1.75mm; Manufacturer Part Number: AT93C46DN-SH-T; ComponentLink2Description: Datasheet; Frequency: 2MHz; Device Class L1: Integrated Circuits (ICs)
Y1 = H130B-12.000-16-2525-EXT-TR: 12MHz ±25ppm Crystal 16pF 35 Ohms 4-SMD, No Lead; Manufacture 1: Raltron Electronics; Value: 12.000MHz; PP Material Stack: 0; Supplier 1: Digi-Key; Stock 1: 4955; Pricing 1: 1=0.590000, 10=0.488000, 50=0.439400, 100=0.390600, 500=0.371100 (USD); Supplier Part Number 1: 2151-H130B-12.000-16-2525-EXT-TR-ND; .Checked SCH: *; .Checked PCB: *; Manufacturer Part Number: H130B-12.000-16-2525-EXT-TR; Part Number: H130B-12.000-16-2525-EXT-TR; Component Group: Crystal; Footprint: 5x3.2mm; Manufacture Part Number 1: H130B-12.000-16-2525-EXT-TR; Pin Count: 4; Mounting Technology: SMT; Component Kind: Standard; Component Type: Standard; PP Rotation: 0

## Sheet sb-sonata-led.SchDoc: LEDs and Switches
size Letter; Organization: NewAE Technology Inc.; Address1: 1083 Queen St., Suite 196; Address2: Halifax; Address3: NS; Address4: Canada B3H 0B2; SheetNumber: 8; SheetTotal: 20; SheetApproved: YES
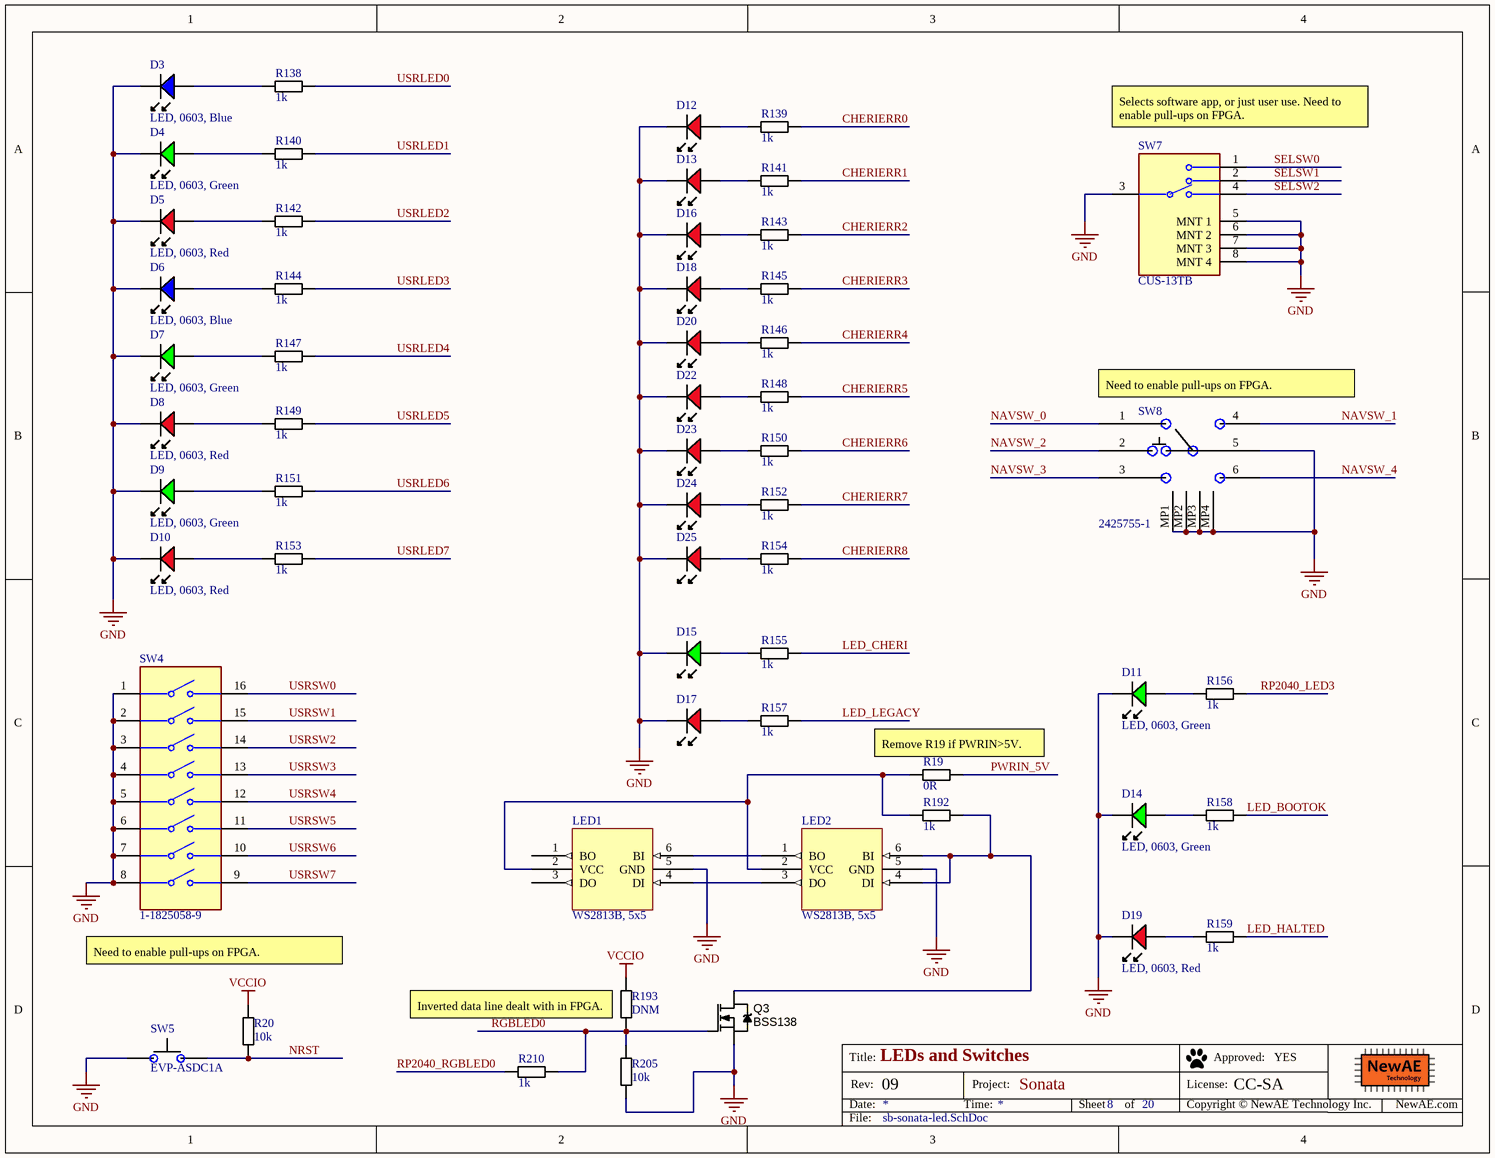
[diagram p4: sb-sonata-led.SchDoc]

### Parts
D3  LED, 0603, Blue  [LED-0603-BLUE]
D4  LED, 0603, Green  [LED-0603-GREEN]
D5  LED, 0603, Red  [LED-0603-RED]
D6  LED, 0603, Blue  [LED-0603-BLUE]
D7  LED, 0603, Green  [LED-0603-GREEN]
D8  LED, 0603, Red  [LED-0603-RED]
D9  LED, 0603, Green  [LED-0603-GREEN]
D10  LED, 0603, Red  [LED-0603-RED]
D11  LED, 0603, Green  [LED-0603-GREEN]
D12  LED, 0603, Red  [LED-0603-RED]  (value not drawn)
D13  LED, 0603, Red  [LED-0603-RED]  (value not drawn)
D14  LED, 0603, Green  [LED-0603-GREEN]
D15  LED, 0603, Green  [LED-0603-GREEN]  (value not drawn)
D16  LED, 0603, Red  [LED-0603-RED]  (value not drawn)
D17  LED, 0603, Red  [LED-0603-RED]  (value not drawn)
D18  LED, 0603, Red  [LED-0603-RED]  (value not drawn)
D19  LED, 0603, Red  [LED-0603-RED]
D20  LED, 0603, Red  [LED-0603-RED]  (value not drawn)
D22  LED, 0603, Red  [LED-0603-RED]  (value not drawn)
D23  LED, 0603, Red  [LED-0603-RED]  (value not drawn)
D24  LED, 0603, Red  [LED-0603-RED]  (value not drawn)
D25  LED, 0603, Red  [LED-0603-RED]  (value not drawn)
LED1  WS2813B, 5x5  [WS2813B_5x5]
LED2  WS2813B, 5x5  [WS2813B_5x5]
Q3  BSS138  [SOT95P245X110-3M]
R19  0R  [RESC1608X55N]
R20  10k  [RESC1005X40N]
R138  1k  [RESC1005X40N]
R139  1k  [RESC1005X40N]
R140  1k  [RESC1005X40N]
R141  1k  [RESC1005X40N]
R142  1k  [RESC1005X40N]
R143  1k  [RESC1005X40N]
R144  1k  [RESC1005X40N]
R145  1k  [RESC1005X40N]
R146  1k  [RESC1005X40N]
R147  1k  [RESC1005X40N]
R148  1k  [RESC1005X40N]
R149  1k  [RESC1005X40N]
R150  1k  [RESC1005X40N]
R151  1k  [RESC1005X40N]
R152  1k  [RESC1005X40N]
R153  1k  [RESC1005X40N]
R154  1k  [RESC1005X40N]
R155  1k  [RESC1005X40N]
R156  1k  [RESC1005X40N]
R157  1k  [RESC1005X40N]
R158  1k  [RESC1005X40N]
R159  1k  [RESC1005X40N]
R192  1k  [RESC1005X40N]
R193  DNM  [RESC1005X40N]
R205  10k  [RESC1005X40N]
R210  1k  [RESC1005X40N]
SW4  1-1825058-9  [FP-1-1825058-9-MFG]
SW5  EVP-ASDC1A  [EVPAS]
SW7  CUS-13TB  [FP-CUS-13TB-MFG]
SW8  2425755-1  [2425755-1]

### Nets
GND: D3.K D4.K D5.K D6.K D7.K D8.K D9.K D10.K D11.K D12.K D13.K D14.K D15.K D16.K D17.K D18.K D19.K D20.K D22.K D23.K D24.K D25.K LED1.5(GND) LED2.5(GND) Q3.2(S) R205.2 SW4.1 SW4.2 SW4.3 SW4.4 SW4.5 SW4.6 SW4.7 SW4.8 SW5.1(IN) SW7.3(C) SW7.5(MNT_1) SW7.6(MNT_2) SW7.7(MNT_3) SW7.8(MNT_4) SW8.5 SW8.MP1 SW8.MP2 SW8.MP3 SW8.MP4
VCCIO: R20.1 R193.1  [project net 3V3_FTDI]
CHERIERR0: R139.1
CHERIERR1: R141.1
CHERIERR2: R143.1
CHERIERR3: R145.1
CHERIERR4: R146.1
CHERIERR5: R148.1
CHERIERR6: R150.1
CHERIERR7: R152.1
CHERIERR8: R154.1
LED_BOOTOK: R158.1
LED_CHERI: R155.1
LED_HALTED: R159.1
LED_LEGACY: R157.1
NAVSW_0: SW8.1
NAVSW_1: SW8.4
NAVSW_2: SW8.2
NAVSW_3: SW8.3
NAVSW_4: SW8.6
NRST: R20.2 SW5.2(IN)
PWRIN_5V: R19.2
RGBLED0: Q3.1(G) R193.2 R205.1 R210.1
RP2040_LED3: R156.1
RP2040_RGBLED0: R210.2
SELSW0: SW7.1
SELSW1: SW7.2
SELSW2: SW7.4
USRLED0: R138.1
USRLED1: R140.1
USRLED2: R142.1
USRLED3: R144.1
USRLED4: R147.1
USRLED5: R149.1
USRLED6: R151.1
USRLED7: R153.1
USRSW0: SW4.16
USRSW1: SW4.15
USRSW2: SW4.14
USRSW3: SW4.13
USRSW4: SW4.12
USRSW5: SW4.11
USRSW6: SW4.10
USRSW7: SW4.9
NetD3_A: D3.A R138.2
NetD4_A: D4.A R140.2
NetD5_A: D5.A R142.2
NetD6_A: D6.A R144.2
NetD7_A: D7.A R147.2
NetD8_A: D8.A R149.2
NetD9_A: D9.A R151.2
NetD10_A: D10.A R153.2
NetD11_A: D11.A R156.2
NetD12_A: D12.A R139.2
NetD13_A: D13.A R141.2
NetD14_A: D14.A R158.2
NetD15_A: D15.A R155.2
NetD16_A: D16.A R143.2
NetD17_A: D17.A R157.2
NetD18_A: D18.A R145.2
NetD19_A: D19.A R159.2
NetD20_A: D20.A R146.2
NetD22_A: D22.A R148.2
NetD23_A: D23.A R150.2
NetD24_A: D24.A R152.2
NetD25_A: D25.A R154.2
NetLED1_2: LED1.2(VCC) LED2.2(VCC) R19.1 R192.1
NetLED1_4: LED1.4(DI) LED2.3(DO)
NetLED1_6: LED1.6(BI) LED2.1(BO)
NetLED2_4: LED2.4(DI) LED2.6(BI) Q3.3(D) R192.2

Not connected (* = marked no-connect by the designer): LED1 1(BO) 3(DO)

### Notes on the sheet
- (near SW7) Selects software app, or just user use. Need to enable pull-ups on FPGA.
- (near SW8) Need to enable pull-ups on FPGA.
- (near R19) Remove R19 if PWRIN>5V.
- Need to enable pull-ups on FPGA.
- (near R193) Inverted data line dealt with in FPGA.
- Title:
- Date:
- Rev:
- Time:
- Project:
- Sheet
- of
- License:
- Copyright © NewAE Technology Inc.
- Approved:
- NewAE.com
- File:

### Library data of the parts
D3 D6 = LEDCHIP_0603_BLUE: Chip LED, Blue; Manufacture 1: Kingbright; Manufacture Part Number 1: APT1608QBC/D; Component Group: Optical; Part Number: LEDCHIP_0603_BLUE; Pin Count: 2; Supplier 1: Digi-Key; Supplier Part Number 1: 754-1434-1-ND; Mounting Technology: SMT; Component Kind: Standard; Component Type: Standard
D4 D7 D9 D11 D14 D15 = LEDCHIP_0603_GREEN: as D26 on sheet sb-sonata-usbrp; Part Number: LEDCHIP_0603_GREEN; Pin Count: 2; Supplier 1: Digi-Key; Supplier Part Number 1: 754-1116-1-ND; Mounting Technology: SMT; Component Kind: Standard; Component Type: Standard
D5 D8 D10 D12 D13 D16-D20 D22-D25 = LEDCHIP_0603_RED: Chip LED, Red; Manufacture 1: Kingbright; Manufacture Part Number 1: APT1608SURCK; Component Group: Optical; PP Material Stack: 15; PP Rotation: -90; Part Number: LEDCHIP_0603_RED; Pin Count: 2; Supplier 1: Digi-Key; Supplier Part Number 1: 754-1123-1-ND; Mounting Technology: SMT; Component Kind: Standard; Component Type: Standard
LED1 LED2 = WS2813B_5x5: WS2813B, 5x5 SMD Neopixel; Manufacture 1: Seeed Studio; Manufacture Part Number 1: 601000200; Component Group: Optical; PP Material Stack: 0; Part Number: WS2813B_5x5; Footprint: 5x5mm SMD; Pin Count: 6; Component Kind: Standard; Component Type: Standard; PP Rotation: 0; PP Rotation1: 0
Q3 = DMN3200U-7: MOSFET N-CH 30V 2.2A SOT23-3; Rated Power: 0.22A; PP Material Stack: 0; Part Number: BSS138; Component Group: MOSFET; Footprint: SOT23; Manufacture Part Number 1: BSS138; Pin Count: 3; Supplier 1: Digi-Key; Rated Voltage: 30V; Mounting Technology: SMT; RoHS: Yes; Component Kind: Standard; Component Type: Standard; PP Rotation: 0
R19 = RCHIP-0R-0603: 0R, 0603, 1/10W; Manufacture 1: Yageo; Manufacture Part Number 1: RC0603FR-070RL; Component Group: Resistor; Case-EIA: 0603; Case-Metric: 1608; Rated Power: 0.1W; Rated Voltage: 75VDC; Tolerance: 1%; Part Number: RCHIP-0R-0603; Footprint: 0603; Pin Count: 2; Supplier 1: Digi-Key; Supplier Part Number 1: 311-0.0HRCT-ND; Value: 0R; Mounting Technology: SMT; Temperature Range: -55C to 155C; Component Kind: Standard; Component Type: Standard
R20 R205 = RCHIP-10K-0402: as R54 on sheet sb-sonata-usbrp; Part Number: RCHIP-10K-0402; Footprint: 0402; Pin Count: 2; Supplier 1: Digi-Key; Supplier Part Number 1: 311-10.0KLRCT-ND; Value: 10k; Tolerance: 1%; Mounting Technology: SMT; Temperature Range: -55C to 155C; Component Kind: Standard; Component Type: Standard
R138-R159 R192 R210 = RCHIP-1K-0402: as R53 on sheet sb-sonata-usbrp; Part Number: RCHIP-1K-0402; Footprint: 0402; Pin Count: 2; Supplier 1: Digi-Key; Supplier Part Number 1: 311-1.00KLRCT-ND; Value: 1k; Tolerance: 1%; Mounting Technology: SMT; Temperature Range: -55C to 155C; Component Kind: Standard; Component Type: Standard
R193 = RCHIP-DNM-0402: Component Group: Resistor; Case-EIA: 0402; Case-Metric: 1005; Part Number: RCHIP-DNM-0402; Footprint: 0402; Pin Count: 2; Value: DNM; Component Kind: Standard; Component Type: Standard
SW4 = CMP-03400-000015-1: SWITCH SLIDE DIP SPST 100MA 24V; Manufacturer: TE Connectivity; Current Rating: 1A; Electromechanical Life: 1000Cycles; Contact Resistance: 50mΩ; Number Of Circuits: 8; Device Class L1: Electromechanical; Manufacturer Part Number: 1-1825058-9; Height: 5.1mm; ComponentLink2Description: Datasheet; Temperature Range High: +85°C; Digikey Description: SWITCH SLIDE DIP SPST 100MA 24V; Voltage Rating Dc: 24V; Package: 0; Automotive: No; ComponentLink2URL: https://www.te.com/commerce/DocumentDelivery/DDEController?Action=showdoc&DocId=Customer+Drawing%7F1825058%7FS5%7Fpdf%7FEnglish%7FENG_CD_1825058_S5.pdf%7F1-1825058-9; Octopart: https://octopart.com/1-1825058-9-te+connectivity-46507285; Temperature Range Low: -30°C; Device Class L2: Switches; Contact Current Rating: 100mA; Mount: Surface Mount; Temperature: -30°C to +85°C; Category: Switch; Device Class L3: DIP Switches; Lead Free: Yes; Throw Configuration: SPST; RoHS: TRUE
SW5 = EVP-ASDC1A: Pushbutton, SMD, 2.5NM force, NO; Manufacture 1: Panasonic; Component Group: Switch; Part Number: EVP-ASDC1A; Manufacture Part Number 1: EVP-ASDC1A; Pin Count: 2; Supplier 1: Digi-Key; Supplier Part Number 1: P16856CT-ND; Mounting Technology: SMT; Component Kind: Standard; Component Type: Standard
SW7 = CMP-71745-000014-1: as SW3 on sheet sb-sonata-usbrp; Contact Plating: Gold; Termination: Gull Wing; Radiation Hardening: No; Series: CUS; Max Operating Temperature: 70°C; Mount: Surface Mount; Switch Travel: 1.5mm; Packaging: Tape and Reel; Min Operating Temperature: -20°C; Contact Material: Copper Alloy; Orientation: Right Angle; Voltage Rating (DC): 4V; RoHS Compliant: Yes; Current Rating: 300mA; Throw Configuration: SP3T
SW8 = 2425755-1: 5-Way Joystick; Manufacture 1: TE; Component Group: Switch; PP Material Stack: 0; Part Number: 2425755-1; Manufacture Part Number 1: 2425755-1; Pin Count: 10; Supplier 1: Digi-Key; Component Kind: Standard; Component Type: Standard; PP Rotation: 0; PP Rotation1: 0

## Sheet sb-sonata-fpgaio2.SchDoc: IO Banks 15 + 16
size Letter; Organization: NewAE Technology Inc.; Address1: 1083 Queen St., Suite 196; Address2: Halifax; Address3: NS; Address4: Canada B3H 0B2; SheetNumber: 13; SheetTotal: 20; SheetApproved: YES
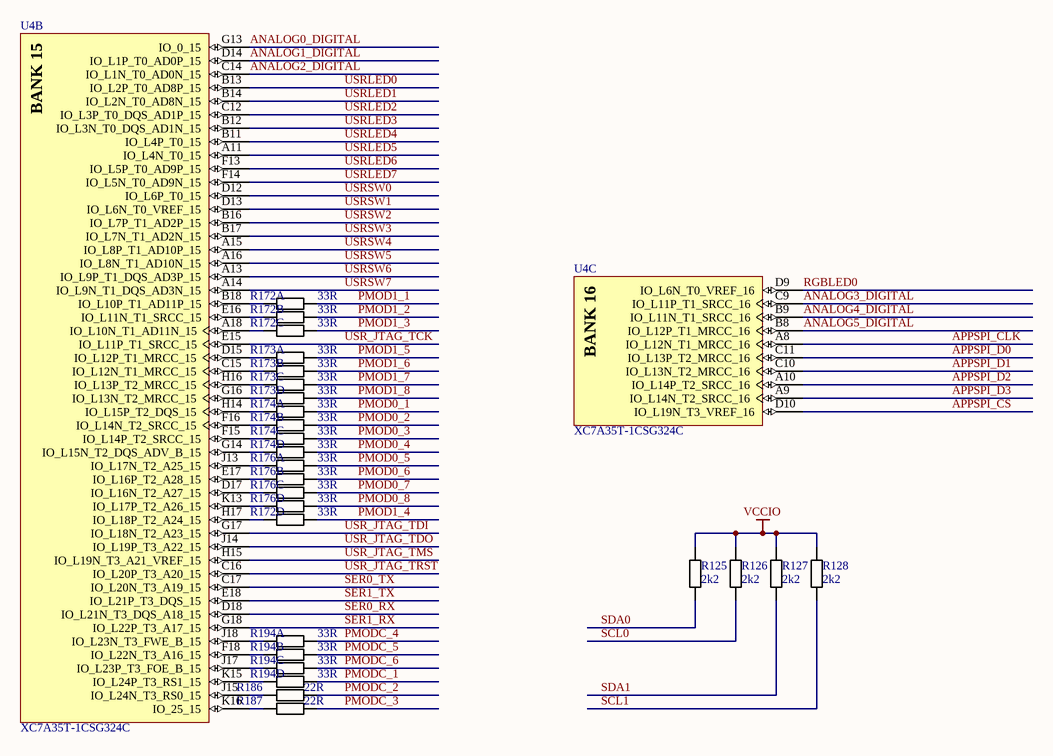
[diagram p5: sb-sonata-fpgaio2.SchDoc]

### Parts
R125  2k2  [RESC1608X55N]
R126  2k2  [RESC1608X55N]
R127  2k2  [RESC1608X55N]
R128  2k2  [RESC1608X55N]
R172  33R  [741C083]  (parts A,B,C,D of 4)
R173  33R  [741C083]  (parts A,B,C,D of 4)
R174  33R  [741C083]  (parts A,B,C,D of 4)
R176  33R  [741C083]  (parts A,B,C,D of 4)
R186  22R  [RESC1005X40N]
R187  22R  [RESC1005X40N]
R194  33R  [741C083]  (parts A,B,C,D of 4)
U4  XC7A35T-1CSG324C  [CSG324]  (parts B,C of 9)

### Nets
VCCIO: R125.1 R126.1 R127.1 R128.1  [project net 3V3_FTDI]
ANALOG0_DIGITAL: U4.G13(IO_0_15)
ANALOG1_DIGITAL: U4.D14(IO_L1P_T0_AD0P_15)
ANALOG2_DIGITAL: U4.C14(IO_L1N_T0_AD0N_15)
ANALOG3_DIGITAL: U4.C9(IO_L11P_T1_SRCC_16)
ANALOG4_DIGITAL: U4.B9(IO_L11N_T1_SRCC_16)
ANALOG5_DIGITAL: U4.B8(IO_L12P_T1_MRCC_16)
APPSPI_CLK: U4.A8(IO_L12N_T1_MRCC_16)
APPSPI_CS: U4.D10(IO_L19N_T3_VREF_16)
APPSPI_D0: U4.C11(IO_L13P_T2_MRCC_16)
APPSPI_D1: U4.C10(IO_L13N_T2_MRCC_16)
APPSPI_D2: U4.A10(IO_L14P_T2_SRCC_16)
APPSPI_D3: U4.A9(IO_L14N_T2_SRCC_16)
PMOD0_1: R174.1B
PMOD0_2: R174.2B
PMOD0_3: R174.3B
PMOD0_4: R174.4B
PMOD0_5: R176.1B
PMOD0_6: R176.2B
PMOD0_7: R176.3B
PMOD0_8: R176.4B
PMOD1_1: R172.1B
PMOD1_2: R172.2B
PMOD1_3: R172.3B
PMOD1_4: R172.4B
PMOD1_5: R173.1B
PMOD1_6: R173.2B
PMOD1_7: R173.3B
PMOD1_8: R173.4B
PMODC_1: R194.4B
PMODC_2: R186.2
PMODC_3: R187.2
PMODC_4: R194.1B
PMODC_5: R194.2B
PMODC_6: R194.3B
RGBLED0: U4.D9(IO_L6N_T0_VREF_16)
SCL0: R126.2
SCL1: R128.2
SDA0: R125.2
SDA1: R127.2
SER0_RX: U4.D18(IO_L21N_T3_DQS_A18_15)
SER0_TX: U4.C17(IO_L20N_T3_A19_15)
SER1_RX: U4.G18(IO_L22P_T3_A17_15)
SER1_TX: U4.E18(IO_L21P_T3_DQS_15)
USR_JTAG_TCK: U4.E15(IO_L11P_T1_SRCC_15)
USR_JTAG_TDI: U4.G17(IO_L18N_T2_A23_15)
USR_JTAG_TDO: U4.J14(IO_L19P_T3_A22_15)
USR_JTAG_TMS: U4.H15(IO_L19N_T3_A21_VREF_15)
USR_JTAG_TRST: U4.C16(IO_L20P_T3_A20_15)
USRLED0: U4.B13(IO_L2P_T0_AD8P_15)
USRLED1: U4.B14(IO_L2N_T0_AD8N_15)
USRLED2: U4.C12(IO_L3P_T0_DQS_AD1P_15)
USRLED3: U4.B12(IO_L3N_T0_DQS_AD1N_15)
USRLED4: U4.B11(IO_L4P_T0_15)
USRLED5: U4.A11(IO_L4N_T0_15)
USRLED6: U4.F13(IO_L5P_T0_AD9P_15)
USRLED7: U4.F14(IO_L5N_T0_AD9N_15)
USRSW0: U4.D12(IO_L6P_T0_15)
USRSW1: U4.D13(IO_L6N_T0_VREF_15)
USRSW2: U4.B16(IO_L7P_T1_AD2P_15)
USRSW3: U4.B17(IO_L7N_T1_AD2N_15)
USRSW4: U4.A15(IO_L8P_T1_AD10P_15)
USRSW5: U4.A16(IO_L8N_T1_AD10N_15)
USRSW6: U4.A13(IO_L9P_T1_DQS_AD3P_15)
USRSW7: U4.A14(IO_L9N_T1_DQS_AD3N_15)
NetR172_1A: R172.1A U4.B18(IO_L10P_T1_AD11P_15)
NetR172_2A: R172.2A U4.E16(IO_L11N_T1_SRCC_15)
NetR172_3A: R172.3A U4.A18(IO_L10N_T1_AD11N_15)
NetR172_4A: R172.4A U4.H17(IO_L18P_T2_A24_15)
NetR173_1A: R173.1A U4.D15(IO_L12P_T1_MRCC_15)
NetR173_2A: R173.2A U4.C15(IO_L12N_T1_MRCC_15)
NetR173_3A: R173.3A U4.H16(IO_L13P_T2_MRCC_15)
NetR173_4A: R173.4A U4.G16(IO_L13N_T2_MRCC_15)
NetR174_1A: R174.1A U4.H14(IO_L15P_T2_DQS_15)
NetR174_2A: R174.2A U4.F16(IO_L14N_T2_SRCC_15)
NetR174_3A: R174.3A U4.F15(IO_L14P_T2_SRCC_15)
NetR174_4A: R174.4A U4.G14(IO_L15N_T2_DQS_ADV_B_15)
NetR176_1A: R176.1A U4.J13(IO_L17N_T2_A25_15)
NetR176_2A: R176.2A U4.E17(IO_L16P_T2_A28_15)
NetR176_3A: R176.3A U4.D17(IO_L16N_T2_A27_15)
NetR176_4A: R176.4A U4.K13(IO_L17P_T2_A26_15)
NetR186_1: R186.1 U4.J15(IO_L24N_T3_RS0_15)
NetR187_1: R187.1 U4.K16(IO_25_15)
NetR194_1A: R194.1A U4.J18(IO_L23N_T3_FWE_B_15)
NetR194_2A: R194.2A U4.F18(IO_L22N_T3_A16_15)
NetR194_3A: R194.3A U4.J17(IO_L23P_T3_FOE_B_15)
NetR194_4A: R194.4A U4.K15(IO_L24P_T3_RS1_15)

### Notes on the sheet
- Title:
- Date:
- Rev:
- Time:
- Project:
- Sheet
- of
- License:
- Copyright © NewAE Technology Inc.
- Approved:
- NewAE.com
- File:
- (in symbol CMP-0383-00012-1, part B) BANK 15
- (in symbol CMP-0383-00012-1, part C) BANK 16

### Library data of the parts
R125-R128 = RCHIP-2K2-0603: 2k2 res, 0603, 1%, 1/10W; Manufacture 1: Yageo; Manufacture Part Number 1: RC0603FR-072K2L; Component Group: Resistor; Case-EIA: 0603; Case-Metric: 1608; Rated Power: 0.1W; Rated Voltage: 75VDC; Part Number: RCHIP-2K2-0603; Footprint: 0603; Pin Count: 2; Supplier 1: Digi-Key; Supplier Part Number 1: 311-2.20KHRCT-ND; Value: 2k2; Tolerance: 1%; Mounting Technology: SMT; Temperature Range: -55C to 155C; Component Kind: Standard; Component Type: Standard
R172-R174 R176 R194 = 741C083330JP: 33-ohm, 0.5mm res array; Manufacture 1: CTS; Component Group: Resistor; PP Material Stack: 0; Part Number: 741C083330JP; Manufacture Part Number 1: 741C083330JP; Pin Count: 8; Supplier 1: Digi-Key; Supplier Part Number 1: 741C083330JPCT-ND; Mounting Technology: SMT; Component Kind: Standard; Component Type: Standard; PP Rotation: 0; PP Rotation1: 0
R186 R187 = RCHIP-22R-0402: as R55 on sheet sb-sonata-usbrp; Part Number: RCHIP-22R-0402; Footprint: 0402; Pin Count: 2; Supplier 1: Digi-Key; Supplier Part Number 1: 311-22.0LRCT-ND; Value: 22R; Tolerance: 1%; Mounting Technology: SMT; Temperature Range: -55C to 155C; Component Kind: Standard; Component Type: Standard
U4 = CMP-0383-00012-1: Artix-7 FPGA, 210 User I/Os, 0 GTP, 324-Ball BGA, Speed Grade 1, Commercial Grade, Pb-Free; Manufacturer: Xilinx; GTP: 0; Available User I/O: 210; Speed Grades: 1; Logic Cells: 33280; Total Block RAM: 1800 Kb; CMTs: 5; Maximum Distributed RAM: 400 Kb; ComponentLink2URL: http://www.xilinx.com/support/documentation/data_sheets/ds180_7Series_Overview.pdf; ComponentLink2Description: Datasheet; DatasheetVersion: Rev. 1.15; PackageDescription: 324-Ball Wire-Bond Chip-Scale BGA, Body 15 x 15 mm, Pitch 0.8 mm; ComponentLink4URL: http://www.xilinx.com/support/documentation/user_guides/ug475_7Series_Pkg_Pinout.pdf; PackageReference: CSG-324; Mounting Technology: Surface Mount; PackageVersion: Rev. 1.11; ComponentLink1Description: Manufacturer URL; ComponentLink3Description: Pinout; ComponentLink1URL: http://www.xilinx.com/; ComponentLink3URL: http://www.xilinx.com/support/documentation/user_guides/ug475_7Series_Pkg_Pinout.pdf; PartNumber: XC7A35T-1CSG324C; ComponentLink4Description: Package Specification; Operating Temperature Range: Commercial